# Altium schematic sheet Power_REF_2V048.SchDoc: 2.048V Reference
size Letter; Engineer: Nathan Petersen; DocumentNumber: 7; Revision: v1.2; SheetNumber: 7; SheetTotal: 29
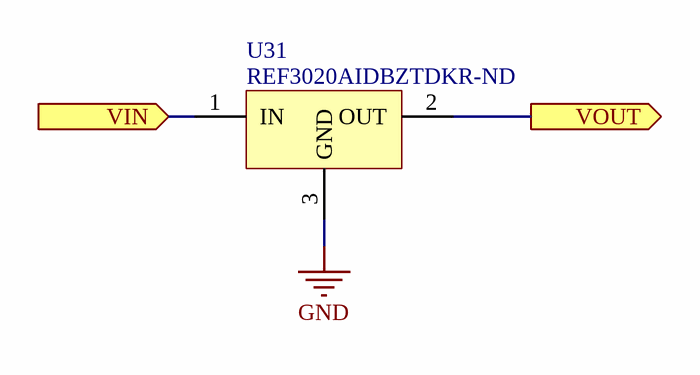
[diagram p0: Power_REF_2V048.SchDoc]

## Parts
U31  Supplier Part Number 1: REF3020AIDBZTDKR-ND  [SOT23-3]  (hidden comment: REF3020AIDBZT)

## Ports
VIN (in), VOUT (out)

## Nets
GND: U31.3(GND)
VIN: U31.1(IN) ; port VIN
VOUT: U31.2(OUT) ; port VOUT

## Notes on the sheet
- Title:
- File:
- Sheet:
- of
- Revision:
- Time:
- Date:
- Engineer:

## Library data of the parts
U31 = REF3020AIDBZT: Series Voltage Reference IC ±0.2% 25mA SOT-23-3; Supplier 1: Digi-Key